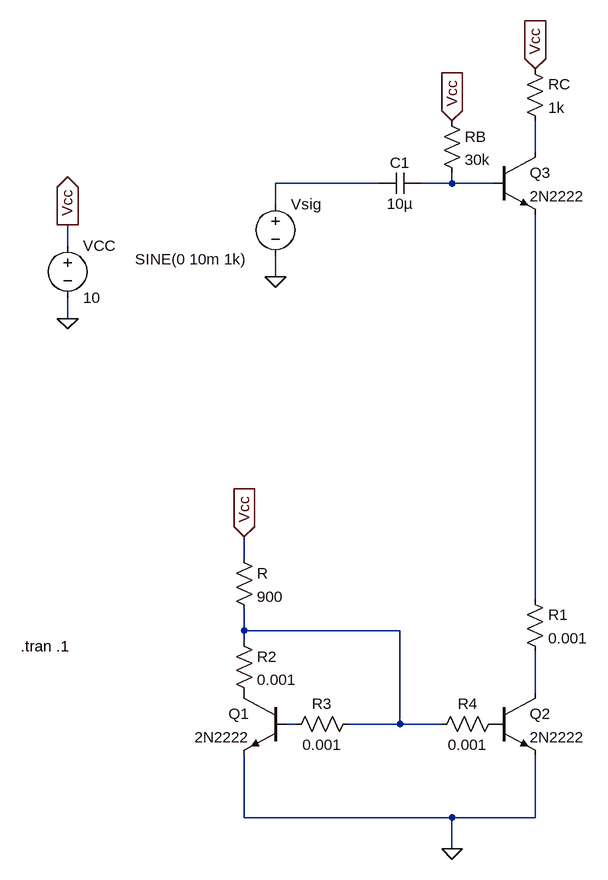
[diagram p0: schematic TBJ - Fonte de Corrente.asc]
TBJ - Fonte de Corrente.asc, the LTspice schematic file:
Version 4
SHEET 1 880 740
WIRE 384 -352 384 -400
WIRE 144 -304 -16 -304
WIRE 256 -304 256 -320
WIRE 256 -304 208 -304
WIRE 320 -304 256 -304
WIRE -16 -272 -16 -304
WIRE -336 -208 -336 -240
WIRE -16 -160 -16 -192
WIRE -336 -96 -336 -128
WIRE -64 272 -64 240
WIRE 384 336 384 -256
WIRE -64 384 -64 352
WIRE 176 384 -64 384
WIRE -64 400 -64 384
WIRE 384 480 384 416
WIRE 16 528 0 528
WIRE 176 528 176 384
WIRE 176 528 96 528
WIRE 240 528 176 528
WIRE -64 672 -64 576
WIRE 256 672 -64 672
WIRE 384 672 384 576
WIRE 384 672 256 672
WIRE 256 720 256 672
FLAG 256 720 0
FLAG -336 -96 0
FLAG -336 -240 Vcc
IOPIN -336 -240 Out
FLAG 384 -480 Vcc
IOPIN 384 -480 In
FLAG 256 -400 Vcc
IOPIN 256 -400 In
FLAG -16 -160 0
FLAG -64 240 Vcc
IOPIN -64 240 In
SYMBOL npn 0 480 M0
SYMATTR InstName Q1
SYMATTR Value 2N2222
SYMBOL npn 320 480 R0
SYMATTR InstName Q2
SYMATTR Value 2N2222
SYMBOL npn 320 -352 R0
SYMATTR InstName Q3
SYMATTR Value 2N2222
SYMBOL res -80 256 R0
SYMATTR InstName R
SYMATTR Value 900
SYMBOL res 240 -416 R0
SYMATTR InstName RB
SYMATTR Value 30k
SYMBOL res 368 -496 R0
SYMATTR InstName RC
SYMATTR Value 1k
SYMBOL voltage -336 -224 R0
WINDOW 123 0 0 Left 0
WINDOW 39 0 0 Left 0
SYMATTR InstName VCC
SYMATTR Value 10
SYMBOL cap 144 -288 R270
WINDOW 0 32 32 VTop 2
WINDOW 3 0 32 VBottom 2
SYMATTR InstName C1
SYMATTR Value 10µ
SYMBOL voltage -16 -288 R0
WINDOW 3 -216 101 Left 2
SYMATTR Value SINE(0 10m 1k)
SYMATTR InstName Vsig
SYMBOL res 368 320 R0
SYMATTR InstName R1
SYMATTR Value 0.001
SYMBOL res -80 384 R0
SYMATTR InstName R2
SYMATTR Value 0.001
SYMBOL res 112 512 R90
WINDOW 0 0 56 VBottom 2
WINDOW 3 32 56 VTop 2
SYMATTR InstName R3
SYMATTR Value 0.001
SYMBOL res 336 512 R90
WINDOW 0 0 56 VBottom 2
WINDOW 3 32 56 VTop 2
SYMATTR InstName R4
SYMATTR Value 0.001
TEXT -408 408 Left 2 !.tran .1

The netlist it stands for:
* TBJ - Fonte de Corrente.asc
Q1 P001 N007 0 0 2N2222
Q2 N006 P002 0 0 2N2222
Q3 N001 N003 N004 0 2N2222
R Vcc N005 900
RB Vcc N003 30k
RC Vcc N001 1k
VCC Vcc 0 10
C1 N002 N003 10µ
Vsig N002 0 SINE(0 10m 1k)
R1 N004 N006 0.001
R2 N005 P001 0.001
R3 N005 N007 0.001
R4 P002 N005 0.001
.model NPN NPN
.model PNP PNP
.lib standard.bjt
.tran .1
.backanno
.end